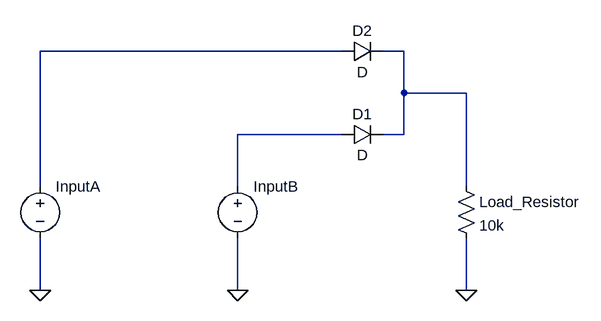
[diagram p0: schematic Experiment 3.asc]
Experiment 3.asc, the LTspice schematic file:
Version 4
SHEET 1 880 680
WIRE 432 -96 -32 -96
WIRE 528 -96 496 -96
WIRE 528 -32 528 -96
WIRE 624 -32 528 -32
WIRE 432 32 272 32
WIRE 528 32 528 -32
WIRE 528 32 496 32
WIRE -32 112 -32 -96
WIRE 272 112 272 32
WIRE 624 112 624 -32
WIRE -32 272 -32 192
WIRE 272 272 272 192
WIRE 624 272 624 192
FLAG -32 272 0
FLAG 272 272 0
FLAG 624 272 0
SYMBOL voltage -32 96 R0
WINDOW 123 0 0 Left 0
WINDOW 39 0 0 Left 0
SYMATTR InstName InputA
SYMATTR Value ""
SYMBOL voltage 272 96 R0
WINDOW 123 0 0 Left 0
WINDOW 39 0 0 Left 0
SYMATTR InstName InputB
SYMATTR Value ""
SYMBOL diode 432 48 R270
WINDOW 0 32 32 VTop 2
WINDOW 3 0 32 VBottom 2
SYMATTR InstName D1
SYMBOL diode 432 -80 R270
WINDOW 0 32 32 VTop 2
WINDOW 3 0 32 VBottom 2
SYMATTR InstName D2
SYMBOL res 608 96 R0
SYMATTR InstName Load_Resistor
SYMATTR Value 10k

The netlist it stands for:
* Experiment 3.asc
V§InputA N001 0
V§InputB N003 0
D1 N003 N002 D
D2 N001 N002 D
R§Load_Resistor N002 0 10k
.model D D
.lib standard.dio
.backanno
.end